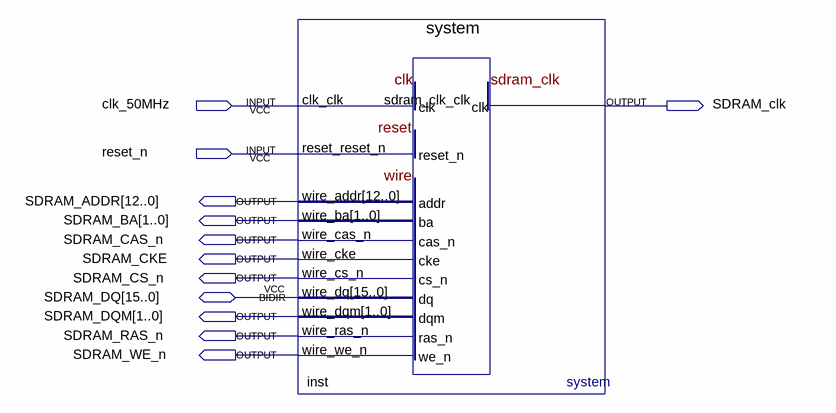
[diagram p0: schematic sheet]
// Quartus schematic Heatmap_System.bdf as structural Verilog: 1 symbols, 12 pins
module Heatmap_System (
  input  clk_50MHz,
  input  reset_n,
  inout  [15:0] SDRAM_DQ,
  output SDRAM_clk,
  output [12:0] SDRAM_ADDR,
  output [1:0] SDRAM_BA,
  output SDRAM_CAS_n,
  output SDRAM_CKE,
  output SDRAM_CS_n,
  output [1:0] SDRAM_DQM,
  output SDRAM_RAS_n,
  output SDRAM_WE_n
);

  system inst (
    .clk_clk(clk_50MHz), .reset_reset_n(reset_n), .sdram_clk_clk(SDRAM_clk), .wire_addr(SDRAM_ADDR),
    .wire_ba(SDRAM_BA), .wire_cas_n(SDRAM_CAS_n), .wire_cke(SDRAM_CKE), .wire_cs_n(SDRAM_CS_n),
    .wire_dqm(SDRAM_DQM), .wire_ras_n(SDRAM_RAS_n), .wire_we_n(SDRAM_WE_n), .wire_dq(SDRAM_DQ));
endmodule
